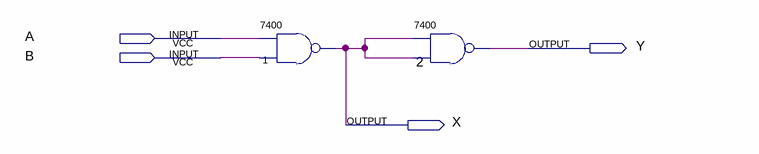
[diagram p0: schematic sheet]
// Quartus schematic Project.bdf as structural Verilog: 2 symbols, 4 pins
module Project (
  input  A,
  input  B,
  output Y,
  output X
);

  \7400  u_1 (.\3 (B), .\2 (A), .\1 (X));
  \7400  u_2 (.\3 (X), .\2 (X), .\1 (Y));
endmodule
